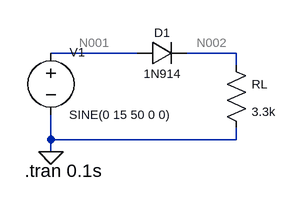
[diagram p0: schematic HALF_Rectifier.asc]
HALF_Rectifier.asc, the LTspice schematic file:
Version 4
SHEET 1 880 680
WIRE -48 -240 -160 -240
WIRE 80 -240 16 -240
WIRE 80 -224 80 -240
WIRE -160 -128 -160 -160
WIRE 80 -128 80 -144
WIRE 80 -128 -160 -128
WIRE -160 -112 -160 -128
FLAG -160 -112 0
SYMBOL res 64 -240 R0
WINDOW 0 36 40 Left 1
WINDOW 3 36 76 Left 1
SYMATTR InstName RL
SYMATTR Value 3.3k
SYMBOL voltage -160 -256 R0
WINDOW 0 34 25 Bottom 1
WINDOW 3 24 96 Left 1
WINDOW 123 0 0 Left 0
WINDOW 39 0 0 Left 0
SYMATTR InstName V1
SYMATTR Value SINE(0 15 50 0 0)
SYMBOL diode -48 -224 R270
WINDOW 0 32 32 VTop 1
WINDOW 3 0 32 VBottom 1
SYMATTR InstName D1
SYMATTR Value 1N914
TEXT -194 -88 Left 2 !.tran 0.1s

The netlist it stands for:
* HALF_Rectifier.asc
RL N002 0 3.3k
V1 N001 0 SINE(0 15 50 0 0)
D1 N001 N002 1N914
.model D D
.lib standard.dio
.tran 0.1s
.backanno
.end

* Results of the author's LTspice run, read from the files saved beside the schematic
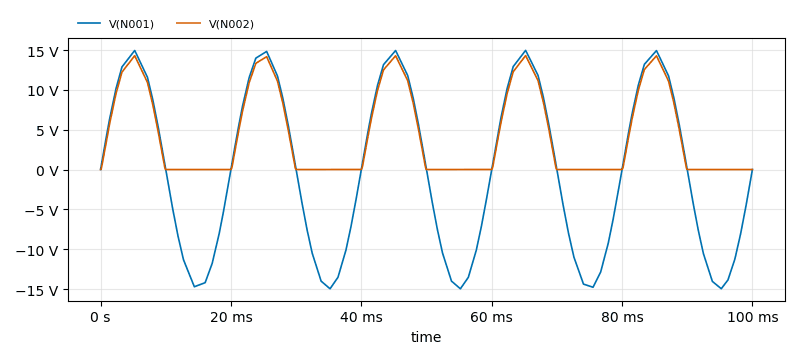
[diagram p1: Transient Analysis of HALF_Rectifier.asc, plotted from the saved traces]
* Transient Analysis, 1 run:
*   V(N001): min -14.97 V, max 14.96 V, average -29.81 mV, rms 10.48 V, last 0 V
*   V(N002): min -63.46 µV, max 14.3 V, average 4.382 V, rms 6.977 V, last 53.75 µV